# Altium schematic sheet PCA_0006_Mini_CB_Plugs_REV_B.SchDoc
size A4; DrawnBy: Philip Rowse
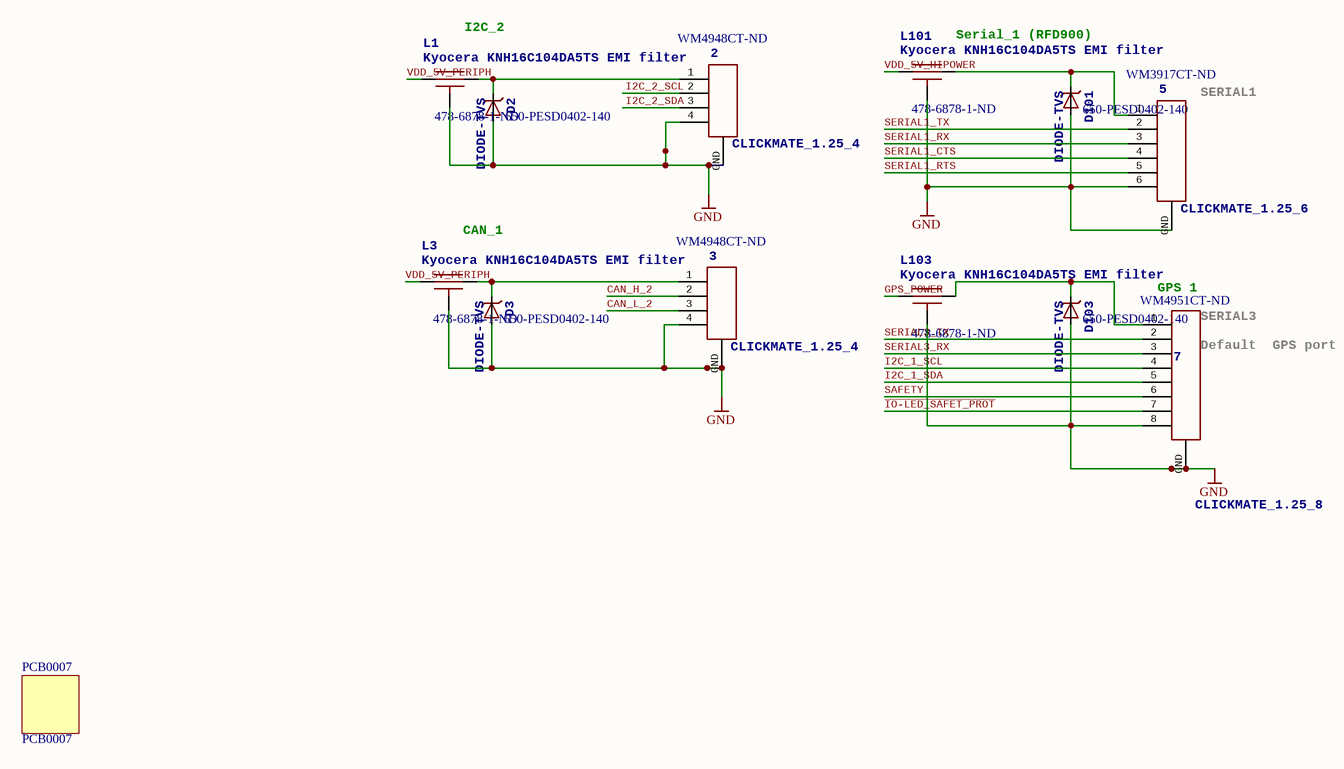
[diagram p0: PCA_0006_Mini_CB_Plugs_REV_B.SchDoc]

## Parts
2  CLICKMATE_1.25_4  Supplier Part Number 1: WM4948CT-ND  [CLICKMATE_H4]
3  CLICKMATE_1.25_4  Supplier Part Number 1: WM4948CT-ND  [CLICKMATE_H4]
5  CLICKMATE_1.25_6  Supplier Part Number 1: WM3917CT-ND  [CLICKMATE_H6]
7  CLICKMATE_1.25_8  Supplier Part Number 1: WM4951CT-ND  [CLICKMATE_H8]
D2  DIODE-TVS  Supplier Part Number 1: 650-PESD0402-140  [0402-TVS]
D3  DIODE-TVS  Supplier Part Number 1: 650-PESD0402-140  [0402-TVS]
D101  DIODE-TVS  Supplier Part Number 1: 650-PESD0402-140  [0402-TVS]
D103  DIODE-TVS  Supplier Part Number 1: 650-PESD0402-140  [0402-TVS]
L1  Kyocera KNH16C104DA5TS EMI filter  Supplier Part Number 1: 478-6878-1-ND  [KYOCERA-KNH16-DA]
L3  Kyocera KNH16C104DA5TS EMI filter  Supplier Part Number 1: 478-6878-1-ND  [KYOCERA-KNH16-DA]
L101  Kyocera KNH16C104DA5TS EMI filter  Supplier Part Number 1: 478-6878-1-ND  [KYOCERA-KNH16-DA]
L103  Kyocera KNH16C104DA5TS EMI filter  Supplier Part Number 1: 478-6878-1-ND  [KYOCERA-KNH16-DA]
PCB0007  PCB0007

## Nets
GND: 2.4 2.GND 3.4 3.GND 5.6 5.GND 7.8 7.GND D2.A D3.A D101.A D103.A L1.GND L3.GND L101.GND L103.GND
CAN_H_2: 3.2
CAN_L_2: 3.3
GPS_POWER: L103.P$1
I2C_1_SCL: 7.4
I2C_1_SDA: 7.5
I2C_2_SCL: 2.2
I2C_2_SDA: 2.3
~{IO-LED_SAFET_PROT}: 7.7
SAFETY: 7.6
SERIAL1_CTS: 5.4
SERIAL1_RTS: 5.5
SERIAL1_RX: 5.3
SERIAL1_TX: 5.2
SERIAL3_RX: 7.3
SERIAL3_TX: 7.2
VDD_5V_HIPOWER: L101.P$1
VDD_5V_PERIPH: L1.P$1 L3.P$1
Net2_1: 2.1 D2.C L1.P$2
Net3_1: 3.1 D3.C L3.P$2
Net5_1: 5.1 D101.C L101.P$2
Net7_1: 7.1 D103.C L103.P$2

## Notes on the sheet
- (near L1) I2C_2
- (near L101) Serial_1 (RFD900)
- (near 5) SERIAL1
- (near L3) CAN_1
- (near 7) GPS 1
- (near 7) SERIAL3
- (near 7) Default
  GPS port
- This licence Applies to this doccument ONLY, other components that make up the full system come with their own licences, please check with the Author for further information
- To the extent possible under law, Philip Rowse and 3DRobotics has waived all copyright and related or neighboring
- rights to Carrier board for APM 3.0 series. This work is published from: United States, and Australia
- Title:
- Date:
- Time:
- For information on this Licence: http://creativecommons.org/publicdomain/zero/1.0/
- Sheet:
- Approved:
- of:
- Drawn By:
- Checked By:
- 3DRobotics

## Library data of the parts
2 3 = CLICKMATE_1.25_4: Connector, Receptacle, 4Pos, 1.25MM, R/A, SMD, Tin; 3DR_PARTNO: ECM0531; Supplier 1: Digi-Key
5 = CLICKMATE_1.25_6: 1.25 W/B SGL R/A REC ASSY 6CKT; 3DR_PARTNO: ECM0532; Supplier 1: Digi-Key
7 = CLICKMATE_1.25_8: Connector, Receptacle, 8Pos, 1.25MM, R/A, SMD, Tin; 3DR_PARTNO: ECM0533; Supplier 1: Digi-Key
D2 D3 D101 D103 = DIODE-TVS: Diode, TVS, 14VWM, 40VC, 0402, SMD; 3DR_PARTNO: ECM0837; Supplier 1: Mouser
L1 L3 L101 L103 = KNH16C104DA5TS: Capacitor, Filter, 0.1uF, 25V, 2A, 0603, SMD; 3DR_PARTNO: ECM0719; Supplier 1: Digi-Key
PCB0007 = PCB_0007: PCB, Carrier Mini, PX2, Board; 3DR_PARTNO: PCB0007; Value: PCB0007